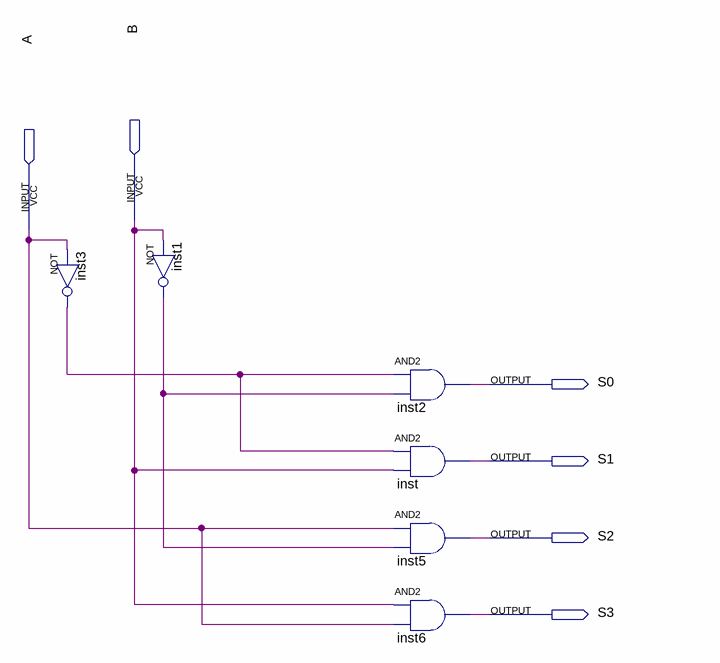
[diagram p0: schematic sheet]
// Quartus schematic DECODER2_4.bdf as structural Verilog: 6 symbols, 6 pins
module DECODER2_4 (
  input  B,
  input  A,
  output S0,
  output S1,
  output S2,
  output S3
);

  wire inst1_out, inst3_out;

  not inst3 (inst3_out, A);
  not inst1 (inst1_out, B);
  and inst2 (S0, inst3_out, inst1_out);
  and inst (S1, inst3_out, B);
  and inst5 (S2, A, inst1_out);
  and inst6 (S3, B, A);
endmodule
